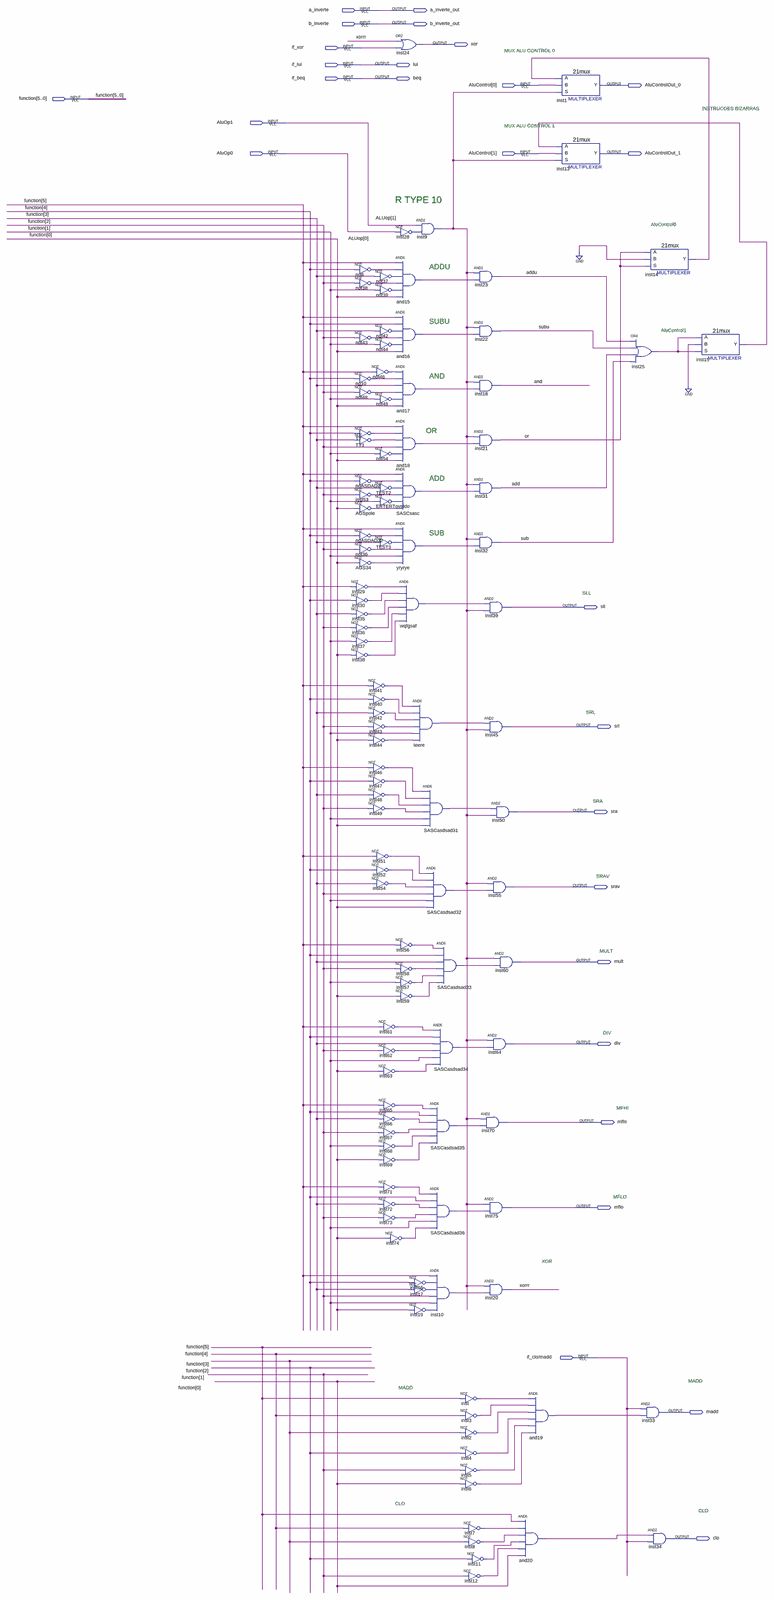
[diagram p0: schematic sheet, whole]
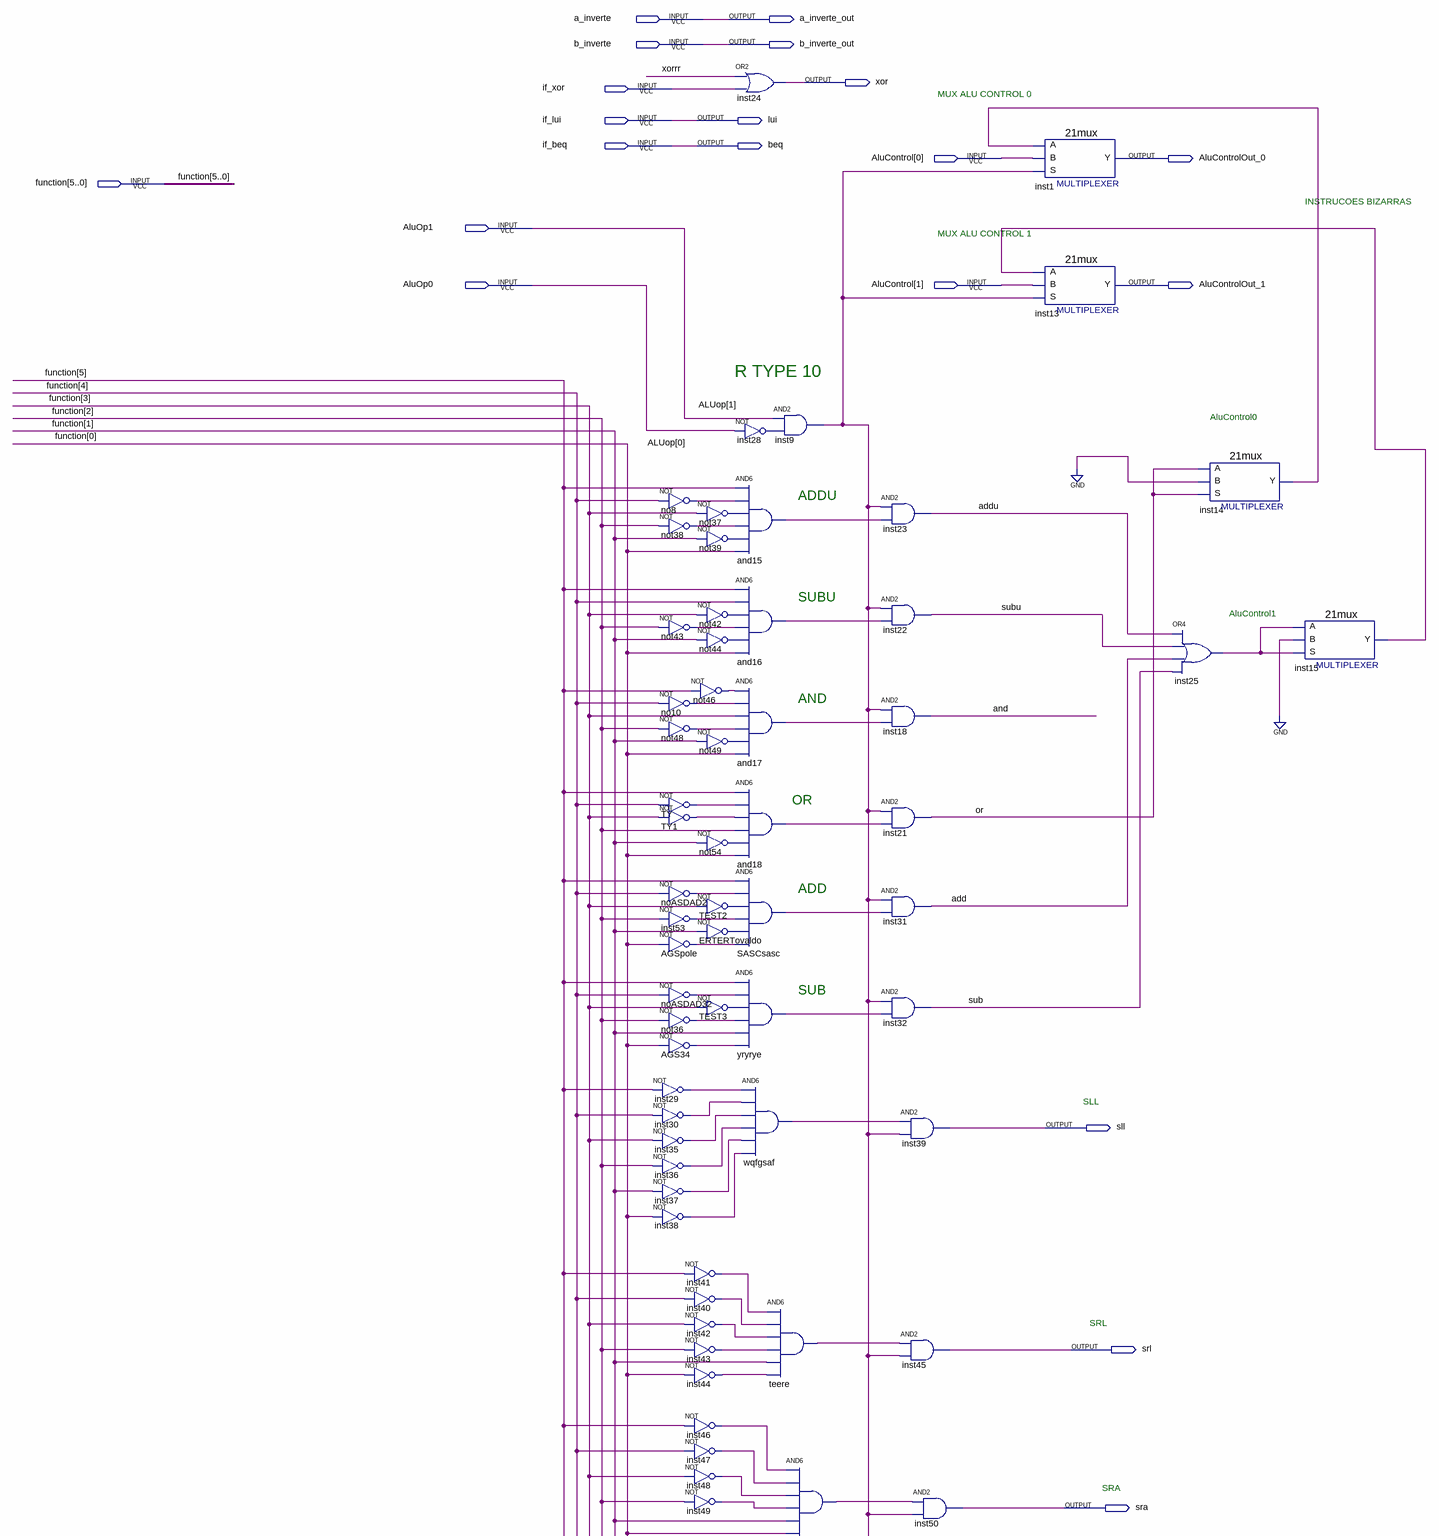
[diagram p1: schematic sheet, upper part]
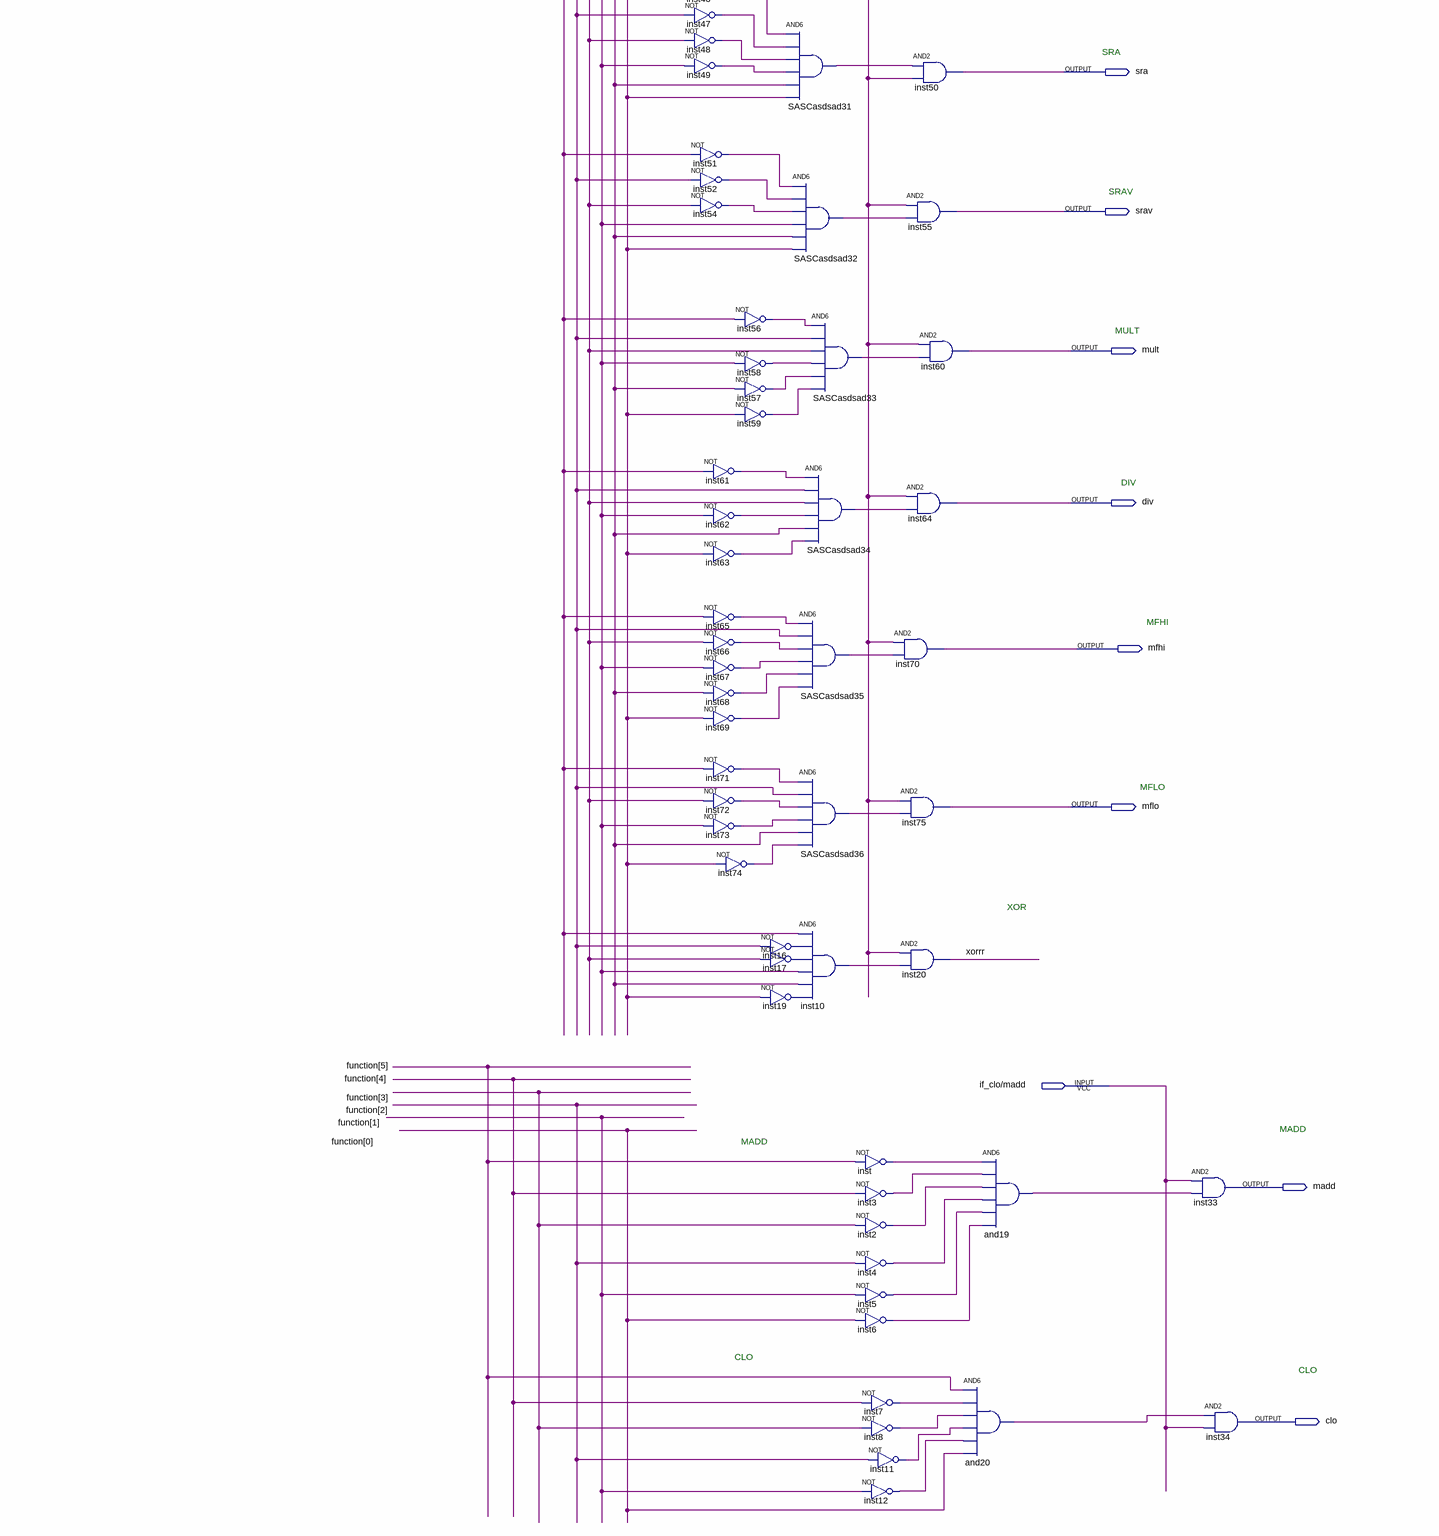
[diagram p2: schematic sheet, lower part]
// Quartus schematic ControleUla.bdf as structural Verilog: 112 symbols, 28 pins
module ControleUla (
  input  a_inverte,
  input  b_inverte,
  input  if_xor,
  input  if_lui,
  input  if_beq,
  input  [1:0] AluControl,
  input  [5:0] \function ,
  input  AluOp1,
  input  AluOp0,
  input  \if_clo/madd ,
  output a_inverte_out,
  output b_inverte_out,
  output \xor ,
  output lui,
  output beq,
  output AluControlOut_0,
  output AluControlOut_1,
  output sll,
  output srl,
  output sra,
  output srav,
  output mult,
  output div,
  output mfhi,
  output mflo,
  output madd,
  output clo
);

  wire add, addu, AGS34_out, AGSpole_out, \and , and15_out, and16_out, and17_out, and18_out, and19_out,
       and20_out, ERTERTovaldo_out, inst2_out, inst3_out, inst4_out, inst5_out, inst6_out, inst7_out,
       inst8_out, inst9_out, inst10_out, inst11_out, inst12_out, inst14_y, inst15_y, inst16_out, inst17_out,
       inst19_out, inst25_out, inst28_out, inst29_out, inst30_out, inst35_out, inst36_out, inst37_out,
       inst38_out, inst40_out, inst41_out, inst42_out, inst43_out, inst44_out, inst46_out, inst47_out,
       inst48_out, inst49_out, inst51_out, inst52_out, inst53_out, inst54_out, inst56_out, inst57_out,
       inst58_out, inst59_out, inst61_out, inst62_out, inst63_out, inst65_out, inst66_out, inst67_out,
       inst68_out, inst69_out, inst71_out, inst72_out, inst73_out, inst74_out, inst_out, no8_out, no10_out,
       noASDAD2_out, noASDAD32_out, not36_out, not37_out, not38_out, not39_out, not42_out, not43_out,
       not44_out, not46_out, not48_out, not49_out, not54_out, \or , SASCasdsad31_out, SASCasdsad32_out,
       SASCasdsad33_out, SASCasdsad34_out, SASCasdsad35_out, SASCasdsad36_out, SASCsasc_out, sub, subu,
       teere_out, TEST2_out, TEST3_out, TY1_out, TY_out, wqfgsaf_out, xorrr, yryrye_out;

  not no8 (no8_out, \function [4]);
  not not37 (not37_out, \function [3]);
  not not38 (not38_out, \function [2]);
  not not39 (not39_out, \function [1]);
  not not42 (not42_out, \function [3]);
  not not43 (not43_out, \function [2]);
  not not44 (not44_out, \function [1]);
  not not46 (not46_out, \function [5]);
  not no10 (no10_out, \function [4]);
  not not48 (not48_out, \function [2]);
  not not49 (not49_out, \function [1]);
  not TY (TY_out, \function [4]);
  not TY1 (TY1_out, \function [3]);
  not not54 (not54_out, \function [1]);
  not noASDAD2 (noASDAD2_out, \function [4]);
  not TEST2 (TEST2_out, \function [3]);
  not inst53 (inst53_out, \function [2]);
  not ERTERTovaldo (ERTERTovaldo_out, \function [1]);
  not AGSpole (AGSpole_out, \function [0]);
  not noASDAD32 (noASDAD32_out, \function [4]);
  not TEST3 (TEST3_out, \function [3]);
  not not36 (not36_out, \function [2]);
  not AGS34 (AGS34_out, \function [0]);
  not inst29 (inst29_out, \function [5]);
  not inst30 (inst30_out, \function [4]);
  not inst35 (inst35_out, \function [3]);
  not inst36 (inst36_out, \function [2]);
  not inst37 (inst37_out, \function [1]);
  not inst38 (inst38_out, \function [0]);
  not inst41 (inst41_out, \function [5]);
  not inst40 (inst40_out, \function [4]);
  not inst42 (inst42_out, \function [3]);
  not inst43 (inst43_out, \function [2]);
  not inst44 (inst44_out, \function [0]);
  not inst46 (inst46_out, \function [5]);
  not inst47 (inst47_out, \function [4]);
  not inst48 (inst48_out, \function [3]);
  not inst49 (inst49_out, \function [2]);
  not inst51 (inst51_out, \function [5]);
  not inst52 (inst52_out, \function [4]);
  not inst54 (inst54_out, \function [3]);
  or inst24 (\xor , xorrr, if_xor);
  not inst28 (inst28_out, AluOp0);
  and and15 (and15_out, \function [5], no8_out, not37_out, not38_out, not39_out, \function [0]);
  and and16 (and16_out, \function [5], \function [4], not42_out, not43_out, not44_out, \function [0]);
  and and17 (and17_out, not46_out, no10_out, \function [3], not48_out, not49_out, \function [0]);
  and and18 (and18_out, \function [5], TY_out, TY1_out, \function [2], not54_out, \function [0]);
  and SASCsasc (SASCsasc_out, \function [5], noASDAD2_out, TEST2_out, inst53_out, ERTERTovaldo_out, AGSpole_out);
  and yryrye (yryrye_out, \function [5], noASDAD32_out, TEST3_out, not36_out, \function [1], AGS34_out);
  and wqfgsaf (wqfgsaf_out, inst29_out, inst30_out, inst35_out, inst36_out, inst37_out, inst38_out);
  not inst56 (inst56_out, \function [5]);
  not inst58 (inst58_out, \function [2]);
  not inst57 (inst57_out, \function [1]);
  not inst59 (inst59_out, \function [0]);
  not inst61 (inst61_out, \function [5]);
  not inst62 (inst62_out, \function [2]);
  not inst63 (inst63_out, \function [0]);
  not inst65 (inst65_out, \function [5]);
  not inst66 (inst66_out, \function [3]);
  not inst67 (inst67_out, \function [2]);
  not inst68 (inst68_out, \function [1]);
  not inst69 (inst69_out, \function [0]);
  not inst71 (inst71_out, \function [5]);
  not inst72 (inst72_out, \function [3]);
  not inst73 (inst73_out, \function [2]);
  not inst74 (inst74_out, \function [0]);
  and inst9 (inst9_out, AluOp1, inst28_out);
  and teere (teere_out, inst41_out, inst40_out, inst42_out, inst43_out, \function [1], inst44_out);
  and SASCasdsad31 (SASCasdsad31_out, inst46_out, inst47_out, inst48_out, inst49_out, \function [1], \function [0]);
  and SASCasdsad32 (SASCasdsad32_out, inst51_out, inst52_out, inst54_out, \function [2], \function [1], \function [0]);
  and SASCasdsad35 (SASCasdsad35_out, inst65_out, \function [4], inst66_out, inst67_out, inst68_out, inst69_out);
  and SASCasdsad36 (SASCasdsad36_out, inst71_out, \function [4], inst72_out, inst73_out, \function [1], inst74_out);
  and inst10 (inst10_out, \function [5], inst16_out, inst17_out, \function [2], \function [1], inst19_out);
  not inst16 (inst16_out, \function [4]);
  not inst17 (inst17_out, \function [3]);
  not inst19 (inst19_out, \function [0]);
  and SASCasdsad33 (SASCasdsad33_out, inst56_out, \function [4], \function [3], inst58_out, inst57_out, inst59_out);
  and SASCasdsad34 (SASCasdsad34_out, inst61_out, \function [4], \function [3], inst62_out, \function [1], inst63_out);
  and inst23 (addu, inst9_out, and15_out);
  and inst22 (subu, inst9_out, and16_out);
  and inst18 (\and , inst9_out, and17_out);
  and inst21 (\or , inst9_out, and18_out);
  and inst31 (add, inst9_out, SASCsasc_out);
  and inst32 (sub, inst9_out, yryrye_out);
  and inst39 (sll, wqfgsaf_out, inst9_out);
  and inst45 (srl, teere_out, inst9_out);
  and inst70 (mfhi, inst9_out, SASCasdsad35_out);
  and inst75 (mflo, inst9_out, SASCasdsad36_out);
  and inst20 (xorrr, inst9_out, inst10_out);
  not inst (inst_out, \function [5]);
  not inst3 (inst3_out, \function [4]);
  not inst2 (inst2_out, \function [3]);
  not inst4 (inst4_out, \function [2]);
  not inst5 (inst5_out, \function [1]);
  not inst6 (inst6_out, \function [0]);
  not inst7 (inst7_out, \function [4]);
  not inst8 (inst8_out, \function [3]);
  not inst11 (inst11_out, \function [2]);
  not inst12 (inst12_out, \function [1]);
  and inst50 (sra, SASCasdsad31_out, inst9_out);
  and inst55 (srav, inst9_out, SASCasdsad32_out);
  and inst60 (mult, inst9_out, SASCasdsad33_out);
  and inst64 (div, inst9_out, SASCasdsad34_out);
  and and19 (and19_out, inst_out, inst3_out, inst2_out, inst4_out, inst5_out, inst6_out);
  and and20 (and20_out, \function [5], inst7_out, inst8_out, inst11_out, inst12_out, \function [0]);
  \21mux  inst1 (.S(inst9_out), .B(AluControl[0]), .A(inst14_y), .Y(AluControlOut_0));
  \21mux  inst13 (.S(inst9_out), .B(AluControl[1]), .A(inst15_y), .Y(AluControlOut_1));
  \21mux  inst14 (.S(\or ), .B(1'b0), .A(\or ), .Y(inst14_y));
  or inst25 (inst25_out, addu, subu, add, sub);
  and inst33 (madd, \if_clo/madd , and19_out);
  and inst34 (clo, and20_out, \if_clo/madd );
  \21mux  inst15 (.S(inst25_out), .B(1'b0), .A(inst25_out), .Y(inst15_y));

  assign a_inverte_out = a_inverte;
  assign b_inverte_out = b_inverte;
  assign beq = if_beq;
  assign lui = if_lui;

  // Notes on the sheet:
  //   MUX ALU CONTROL 0
  //   INSTRUCOES BIZARRAS
  //   MUX ALU CONTROL 1
  //   R TYPE 10
  //   AluControl0
  //   ADDU
  //   SUBU
  //   AluControl1
  //   AND
  //   OR
  //   ADD
  //   SUB
  //   SLL
  //   SRL
  //   SRA
  //   SRAV
  //   MULT
  //   DIV
  //   MFHI
  //   MFLO
  //   XOR
  //   MADD
  //   MADD
  //   CLO
  //   CLO
endmodule
